# EAGLE board LEDprotoFix (EAGLE 6.6.0), part 1 of 2
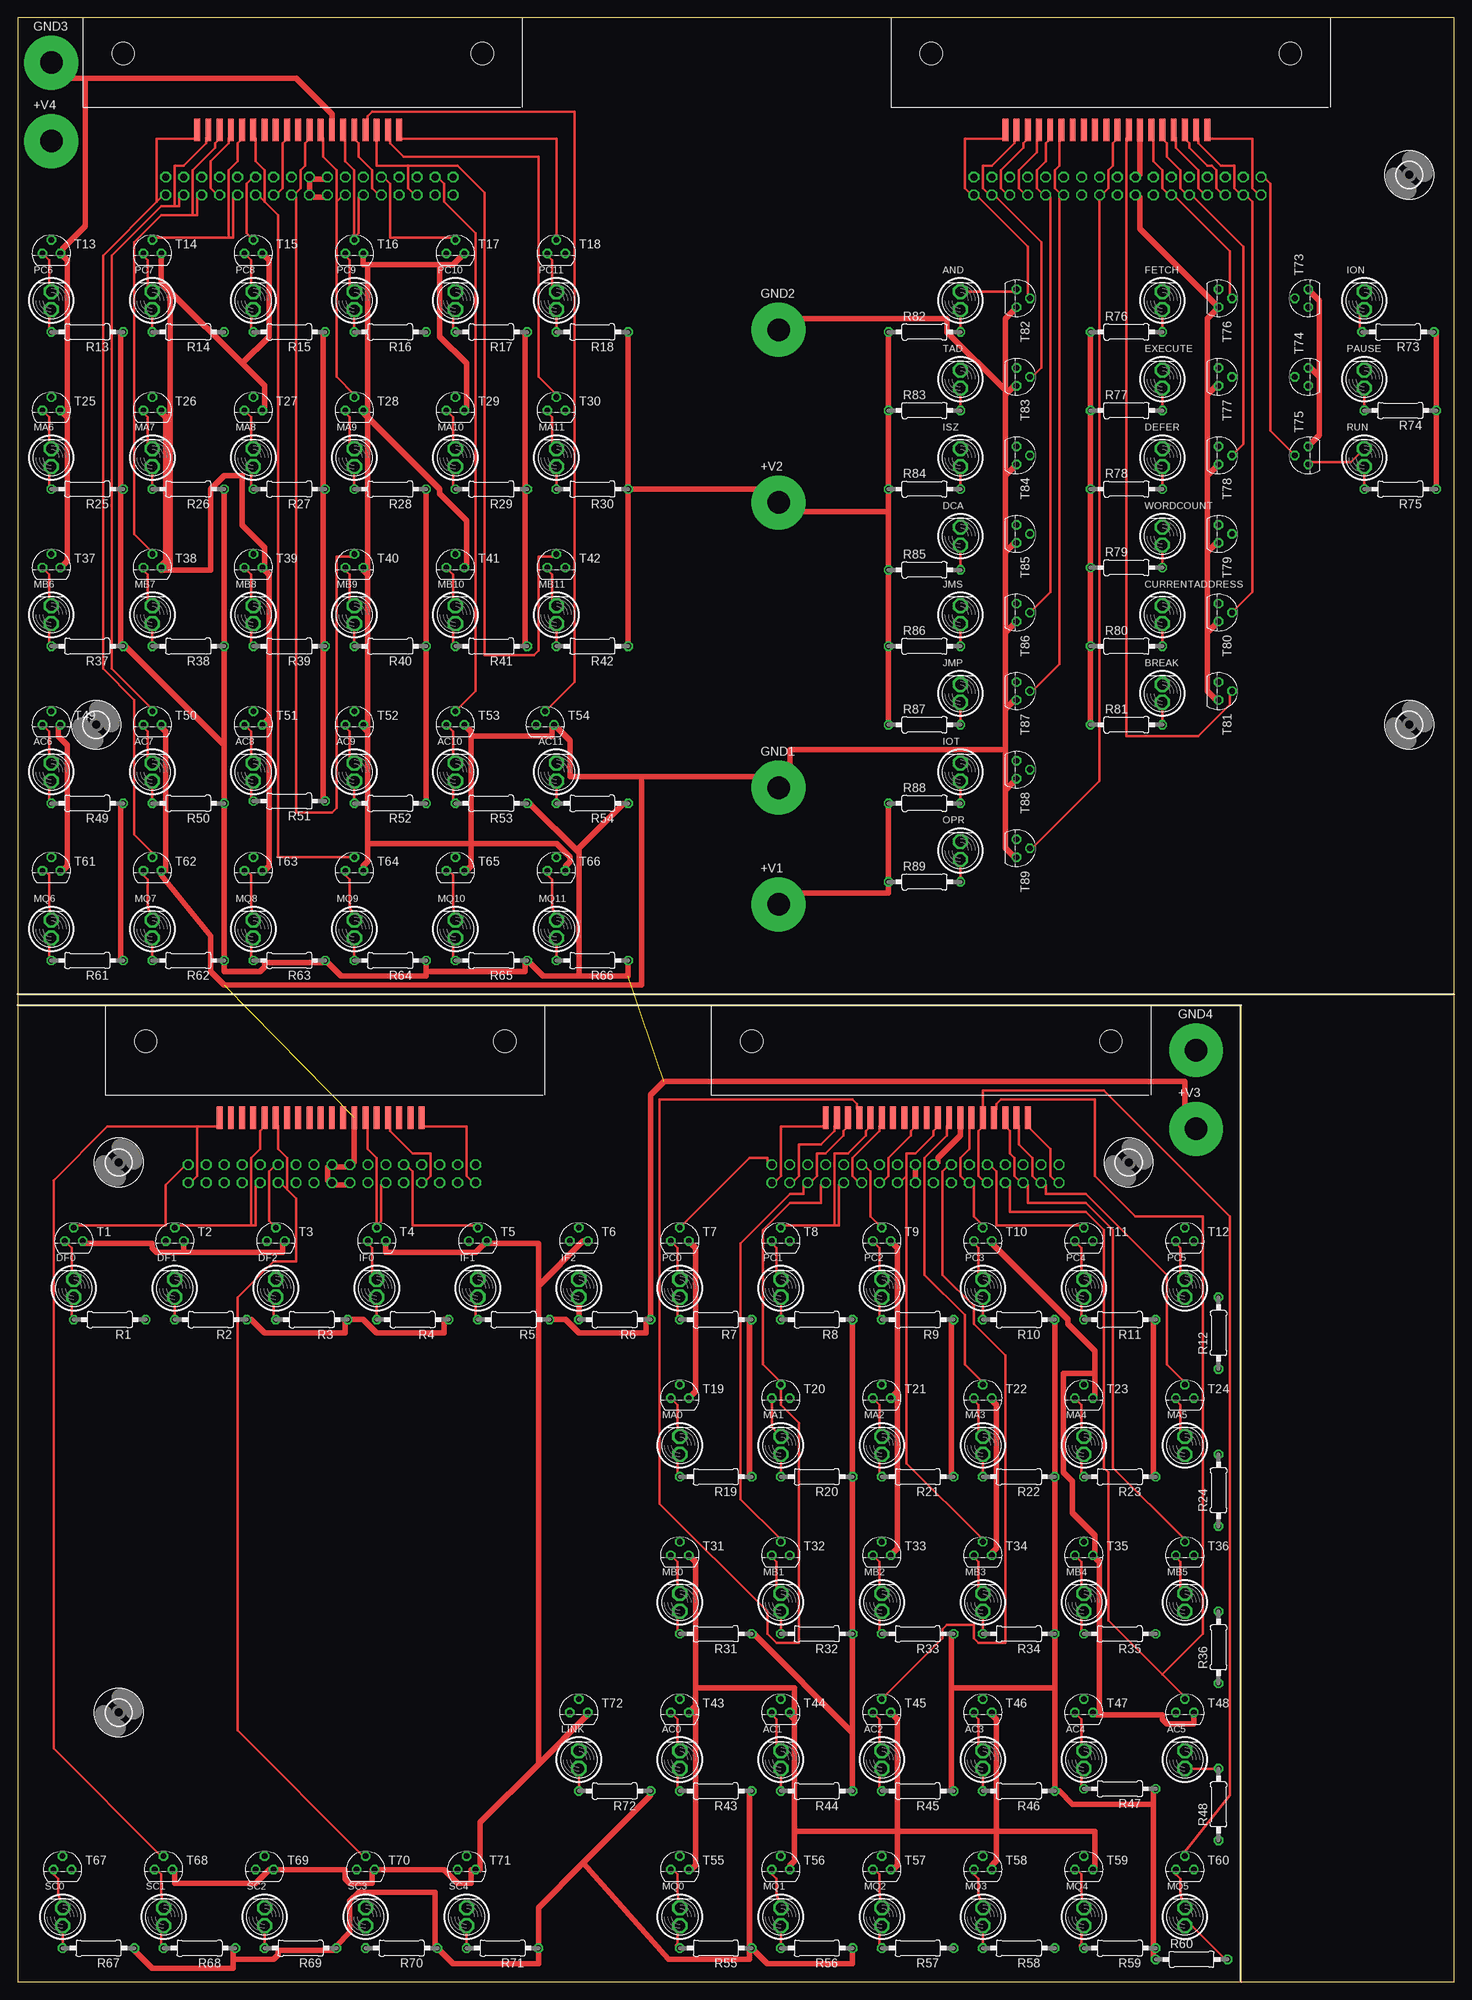
[diagram p2: board, top side]
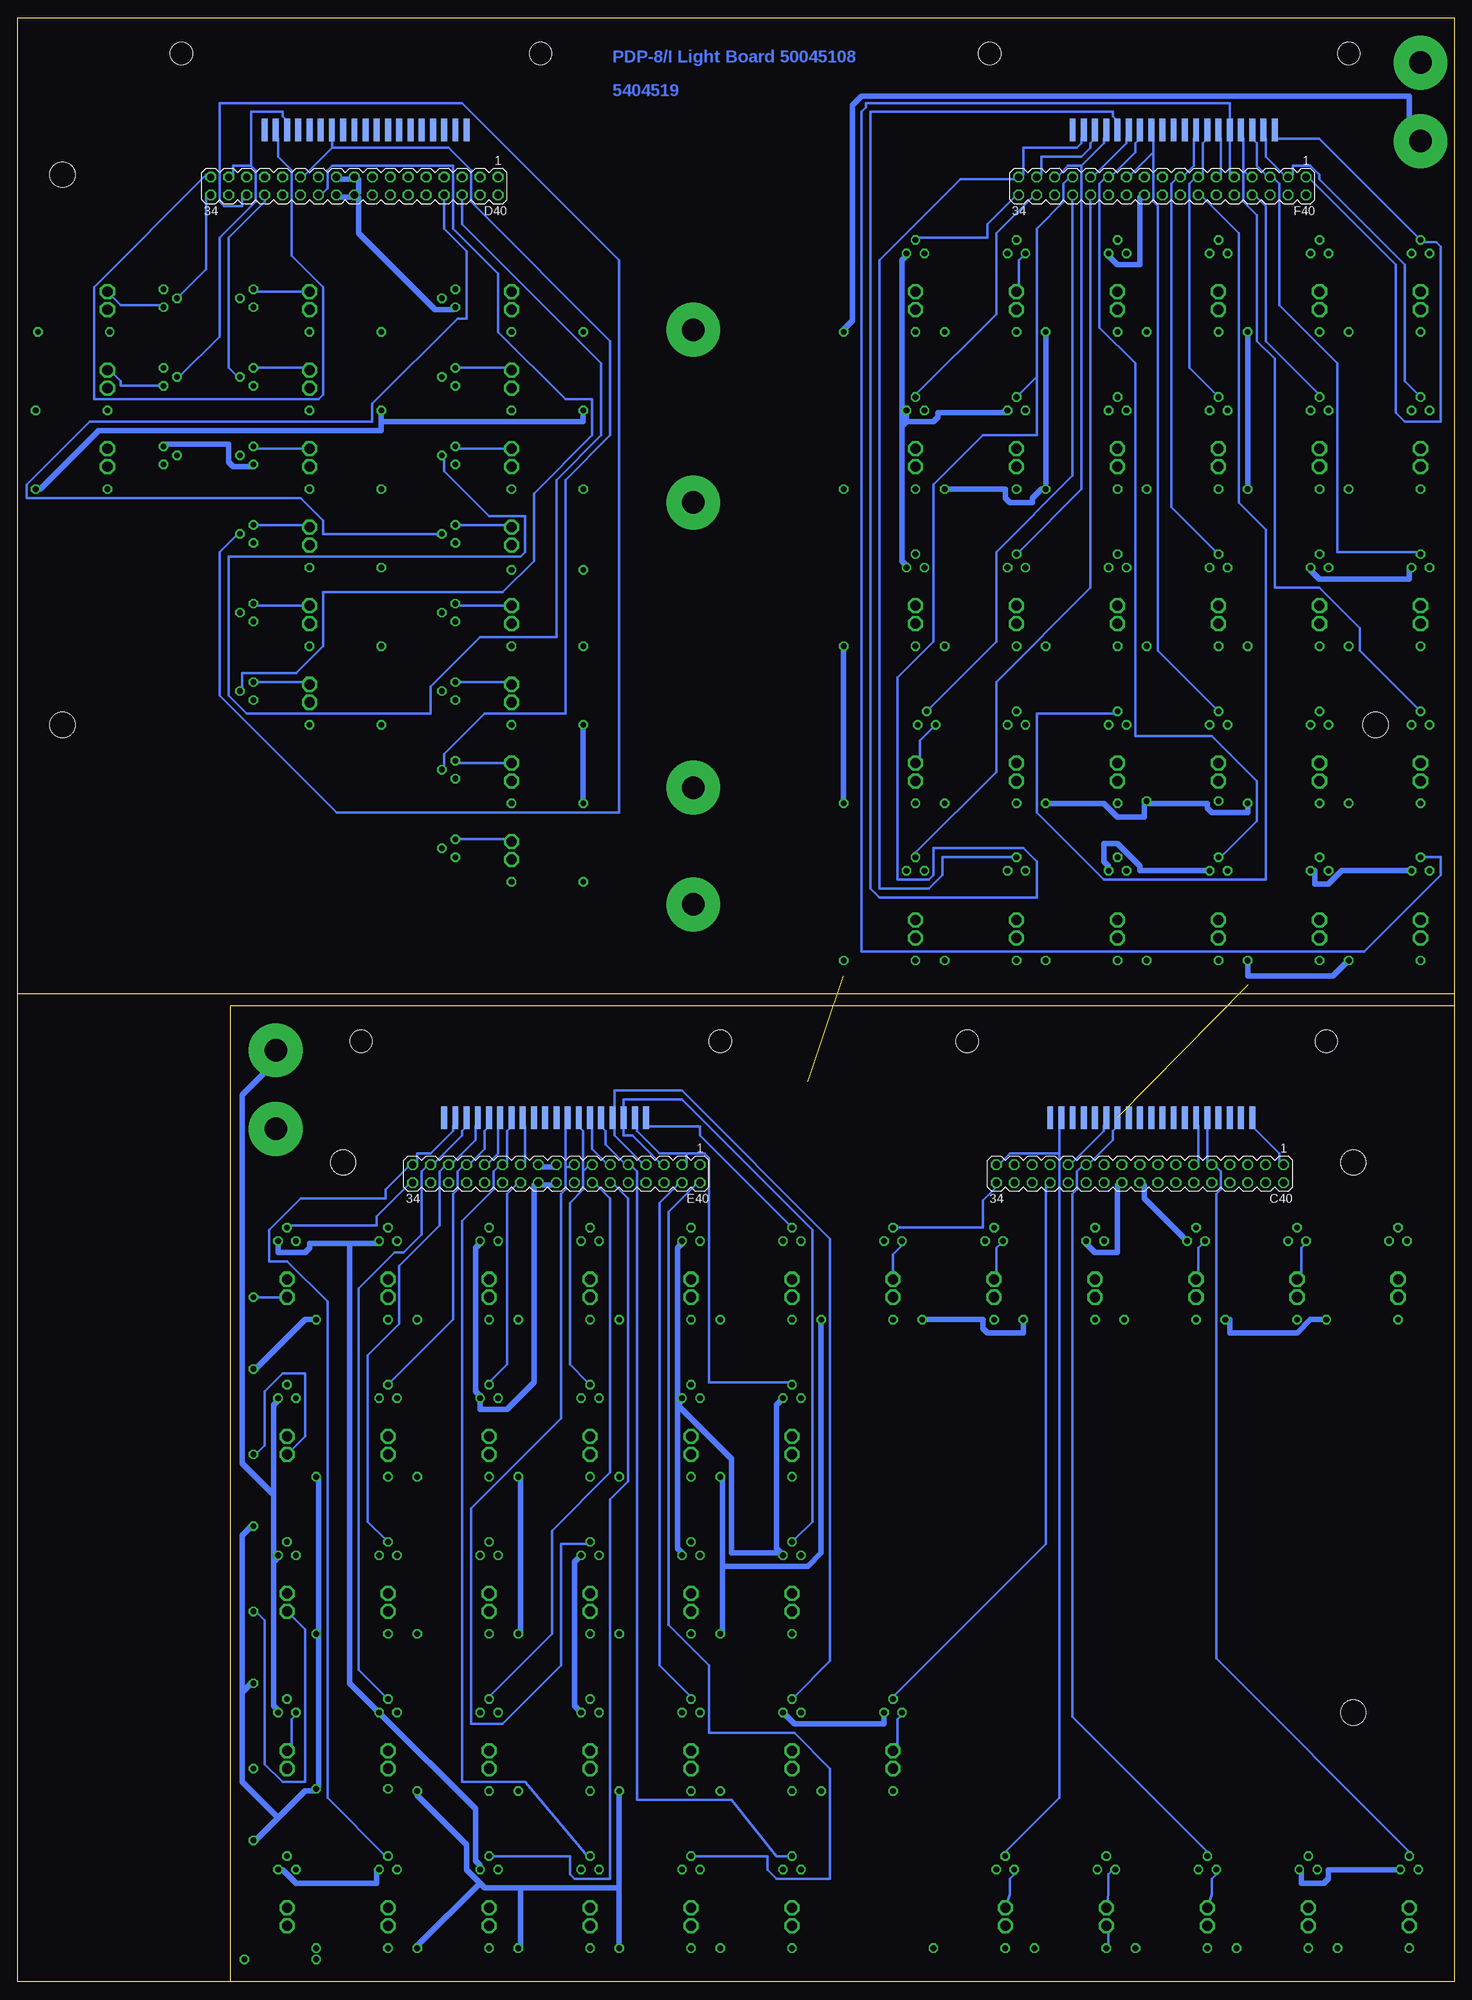
[diagram p3: board, bottom side, seen from below]

Size 203.2 x 277.81 mm. Coordinates in mm from the lower left corner, seen from the top.
Outline: 203.2,277.81 203.2,139.7 0,139.7 0,277.81
Outline: 203.2,277.81 0,277.81
Outline: 0,0 0,138.11 173.04,138.11 173.04,0 0,0
Outline: 0,0 203.2,0 203.2,277.81
Outline: 203.2,277.81 0,277.81
Outline: 0,277.81 0,0
Copper layers (1*16): Top 0.035mm / dielectric 1.5mm / Bottom 0.035mm
Design rules "15mils": minimum track width 15mil, minimum drill 24mil, track to track 15mil, track to pad 10mil, pad to pad 10mil, via to via 10mil, smd to smd 10mil, copper to edge 25mil, drill to drill 10mil, minimum pad ring 10mil, minimum via ring 8mil, stop-mask expansion 0mil, vias tented up to drill 0mil, thermal gap 10mil
Net classes: 1 supply: width 0.762 mm

## Footprints (pad centres in the part's own frame; a part is rotated, then mirrored left to right if it is on the bottom)
SPADELUG = drill 3.175 pad 7.62: 1 0,0
BULB = drill 1.422 octagon: A 0,0; B 0,2.54
MA17-2 = drill 1.016 octagon: 1 -20.32,-1.27; 2 -20.32,1.27; 3 -17.78,-1.27; 4 -17.78,1.27; 5 -15.24,-1.27; 6 -15.24,1.27; 7 -12.7,-1.27; 8 -12.7,1.27; 9 -10.16,-1.27; 10 -10.16,1.27; 11 -7.62,-1.27; 12 -7.62,1.27; 13 -5.08,-1.27; 14 -5.08,1.27; 15 -2.54,-1.27; 16 -2.54,1.27; 17 0,-1.27; 18 0,1.27; 19 2.54,-1.27; 20 2.54,1.27; 21 5.08,-1.27; 22 5.08,1.27; 23 7.62,-1.27; 24 7.62,1.27; 25 10.16,-1.27; 26 10.16,1.27; 27 12.7,-1.27; 28 12.7,1.27; 29 15.24,-1.27; 30 15.24,1.27; 31 17.78,-1.27; 32 17.78,1.27; 33 20.32,-1.27; 34 20.32,1.27
FLEX19 = smd 3.175 x 0.838: 1 0,14.287; 2 0,12.7; 3 0,11.113; 4 0,9.525; 5 0,7.938; 6 0,6.35; 7 0,4.763; 8 0,3.175; 9 0,1.587; 10 0,0; 11 0,-1.587; 12 0,-3.175; 13 0,-4.763; 14 0,-6.35; 15 0,-7.938; 16 0,-9.525; 17 0,-11.113; 18 0,-12.7; 19 0,-14.287
0207/10 = drill 0.813 octagon: 1 -5.08,0; 2 5.08,0
TO92 = drill 0.813 octagon: 1 1.27,0; 2 0,1.905; 3 -1.27,0
STRAIN-RELIEF = hole 3.175: 7.62,56.515; 7.62,5.715
3,6 = hole 3.6: 0,0

## Placement (x,y rotation side)
+V1  LUG  [SPADELUG]  107.63,152.4 0 top
+V2  LUG  [SPADELUG]  107.63,209.23 0 top
+V3  LUG  [SPADELUG]  166.69,120.65 0 top
+V4  LUG  [SPADELUG]  4.76,260.35 0 top
AC0  [BULB]  93.66,30.16 0 top
AC1  [BULB]  107.95,30.16 0 top
AC2  [BULB]  122.24,30.16 0 top
AC3  [BULB]  136.53,30.16 0 top
AC4  [BULB]  150.81,30.16 0 top
AC5  [BULB]  165.1,30.16 0 top
AC6  [BULB]  4.76,169.86 0 top
AC7  [BULB]  19.05,169.86 0 top
AC8  [BULB]  33.34,169.86 0 top
AC9  [BULB]  47.62,169.86 0 top
AC10  [BULB]  61.91,169.86 0 top
AC11  [BULB]  76.2,169.86 0 top
AND  [BULB]  133.35,236.54 0 top
BREAK  [BULB]  161.93,180.97 0 top
C40  [MA17-2]  44.45,114.3 180 bottom
C40BOT  FLEX19  [FLEX19]  42.86,122.24 90 top
C40TOP  FLEX19  [FLEX19]  42.86,122.24 270 bottom
CURRENTADDRESS  [BULB]  161.93,192.09 0 top
D40  [MA17-2]  155.57,254 180 bottom
D40BOT  FLEX19  [FLEX19]  128.59,122.24 90 top
D40TOP  FLEX19  [FLEX19]  128.59,122.24 270 bottom
DCA  [BULB]  133.35,203.2 0 top
DEFER  [BULB]  161.93,214.31 0 top
DF0  [BULB]  7.94,96.84 0 top
DF1  [BULB]  22.23,96.84 0 top
DF2  [BULB]  36.51,96.84 0 top
E40  [MA17-2]  127,114.3 180 bottom
E40BOT  FLEX19  [FLEX19]  39.69,261.94 90 top
E40TOP  FLEX19  [FLEX19]  39.69,261.94 270 bottom
EXECUTE  [BULB]  161.93,225.43 0 top
F40  [MA17-2]  41.27,254 180 bottom
F40BOT  FLEX19  [FLEX19]  153.99,261.94 90 top
F40TOP  FLEX19  [FLEX19]  153.99,261.94 270 bottom
FETCH  [BULB]  161.93,236.54 0 top
GND1  LUG  [SPADELUG]  107.63,168.91 0 top
GND2  LUG  [SPADELUG]  107.63,233.68 0 top
GND3  LUG  [SPADELUG]  4.76,271.46 0 top
GND4  LUG  [SPADELUG]  166.69,131.76 0 top
IF0  [BULB]  50.8,96.84 0 top
IF1  [BULB]  65.09,96.84 0 top
IF2  [BULB]  79.38,96.84 0 top
ION  [BULB]  190.5,236.54 0 top
IOT  [BULB]  133.35,169.86 0 top
ISZ  [BULB]  133.35,214.31 0 top
JMP  [BULB]  133.35,180.97 0 top
JMS  [BULB]  133.35,192.09 0 top
LINK  [BULB]  79.38,30.16 0 top
MA0  [BULB]  93.66,74.61 0 top
MA1  [BULB]  107.95,74.61 0 top
MA2  [BULB]  122.24,74.61 0 top
MA3  [BULB]  136.53,74.61 0 top
MA4  [BULB]  150.81,74.61 0 top
MA5  [BULB]  165.1,74.61 0 top
MA6  [BULB]  4.76,214.31 0 top
MA7  [BULB]  19.05,214.31 0 top
MA8  [BULB]  33.34,214.31 0 top
MA9  [BULB]  47.62,214.31 0 top
MA10  [BULB]  61.91,214.31 0 top
MA11  [BULB]  76.2,214.31 0 top
MB0  [BULB]  93.66,52.39 0 top
MB1  [BULB]  107.95,52.39 0 top
MB2  [BULB]  122.24,52.39 0 top
MB3  [BULB]  136.53,52.39 0 top
MB4  [BULB]  150.81,52.39 0 top
MB5  [BULB]  165.1,52.39 0 top
MB6  [BULB]  4.76,192.09 0 top
MB7  [BULB]  19.05,192.09 0 top
MB8  [BULB]  33.34,192.09 0 top
MB9  [BULB]  47.62,192.09 0 top
MB10  [BULB]  61.91,192.09 0 top
MB11  [BULB]  76.2,192.09 0 top
MQ0  [BULB]  93.66,7.94 0 top
MQ1  [BULB]  107.95,7.94 0 top
MQ2  [BULB]  122.24,7.94 0 top
MQ3  [BULB]  136.53,7.94 0 top
MQ4  [BULB]  150.81,7.94 0 top
MQ5  [BULB]  165.1,7.94 0 top
MQ6  [BULB]  4.76,147.64 0 top
MQ7  [BULB]  19.05,147.64 0 top
MQ8  [BULB]  33.34,147.64 0 top
MQ9  [BULB]  47.62,147.64 0 top
MQ10  [BULB]  61.91,147.64 0 top
MQ11  [BULB]  76.2,147.64 0 top
OPR  [BULB]  133.35,158.75 0 top
PAUSE  [BULB]  190.5,225.43 0 top
PC0  [BULB]  93.66,96.84 0 top
PC1  [BULB]  107.95,96.84 0 top
PC2  [BULB]  122.24,96.84 0 top
PC3  [BULB]  136.53,96.84 0 top
PC4  [BULB]  150.81,96.84 0 top
PC5  [BULB]  165.1,96.84 0 top
PC6  [BULB]  4.76,236.54 0 top
PC7  [BULB]  19.05,236.54 0 top
PC8  [BULB]  33.34,236.54 0 top
PC9  [BULB]  47.62,236.54 0 top
PC10  [BULB]  61.91,236.54 0 top
PC11  [BULB]  76.2,236.54 0 top
R1  1.5K  [0207/10]  13.02,93.66 180 top
R2  1.5K  [0207/10]  27.3,93.66 180 top
R3  1.5K  [0207/10]  41.59,93.66 180 top
R4  1.5K  [0207/10]  55.88,93.66 180 top
R5  1.5K  [0207/10]  70.17,93.66 180 top
R6  1.5K  [0207/10]  84.45,93.66 180 top
R7  1.5K  [0207/10]  98.74,93.66 180 top
R8  1.5K  [0207/10]  113.03,93.66 180 top
R9  1.5K  [0207/10]  127.32,93.66 180 top
R10  1.5K  [0207/10]  141.6,93.66 180 top
R11  1.5K  [0207/10]  155.89,93.66 180 top
R12  1.5K  [0207/10]  169.86,91.76 90 top
R13  1.5K  [0207/10]  9.84,233.36 180 top
R14  1.5K  [0207/10]  24.13,233.36 180 top
R15  1.5K  [0207/10]  38.42,233.36 180 top
R16  1.5K  [0207/10]  52.7,233.36 180 top
R17  1.5K  [0207/10]  66.99,233.36 180 top
R18  1.5K  [0207/10]  81.28,233.36 180 top
R19  1.5K  [0207/10]  98.74,71.44 180 top
R20  1.5K  [0207/10]  113.03,71.44 180 top
R21  1.5K  [0207/10]  127.32,71.44 180 top
R22  1.5K  [0207/10]  141.6,71.44 180 top
R23  1.5K  [0207/10]  155.89,71.44 180 top
R24  1.5K  [0207/10]  169.86,69.53 90 top
R25  1.5K  [0207/10]  9.84,211.14 180 top
R26  1.5K  [0207/10]  24.13,211.14 180 top
R27  1.5K  [0207/10]  38.42,211.14 180 top
R28  1.5K  [0207/10]  52.7,211.14 180 top
R29  1.5K  [0207/10]  66.99,211.14 180 top
R30  1.5K  [0207/10]  81.28,211.14 180 top
R31  1.5K  [0207/10]  98.74,49.21 180 top
R32  1.5K  [0207/10]  113.03,49.21 180 top
R33  1.5K  [0207/10]  127.32,49.21 180 top
R34  1.5K  [0207/10]  141.6,49.21 180 top
R35  1.5K  [0207/10]  155.89,49.21 180 top
R36  1.5K  [0207/10]  169.86,47.31 90 top
R37  1.5K  [0207/10]  9.84,188.91 180 top
R38  1.5K  [0207/10]  24.13,188.91 180 top
R39  1.5K  [0207/10]  38.42,188.91 180 top
R40  1.5K  [0207/10]  52.7,188.91 180 top
R41  1.5K  [0207/10]  66.99,188.91 180 top
R42  1.5K  [0207/10]  81.28,188.91 180 top
R43  1.5K  [0207/10]  98.74,26.99 180 top
R44  1.5K  [0207/10]  113.03,26.99 180 top
R45  1.5K  [0207/10]  127.32,26.99 180 top
R46  1.5K  [0207/10]  141.6,26.99 180 top
R47  1.5K  [0207/10]  155.89,27.3 180 top
R48  1.5K  [0207/10]  169.86,25.08 90 top
R49  1.5K  [0207/10]  9.84,166.69 180 top
R50  1.5K  [0207/10]  24.13,166.69 180 top
R51  1.5K  [0207/10]  38.42,167 180 top
R52  1.5K  [0207/10]  52.7,166.69 180 top
R53  1.5K  [0207/10]  66.99,166.69 180 top
R54  1.5K  [0207/10]  81.28,166.69 180 top
R55  1.5K  [0207/10]  98.74,4.76 180 top
R56  1.5K  [0207/10]  113.03,4.76 180 top
R57  1.5K  [0207/10]  127.32,4.76 180 top
R58  1.5K  [0207/10]  141.6,4.76 180 top
R59  1.5K  [0207/10]  155.89,4.76 180 top
R60  1.5K  [0207/10]  166.05,3.17 0 top
R61  1.5K  [0207/10]  9.84,144.46 180 top
R62  1.5K  [0207/10]  24.13,144.46 180 top
R63  1.5K  [0207/10]  38.42,144.46 180 top
R64  1.5K  [0207/10]  52.7,144.46 180 top
R65  1.5K  [0207/10]  66.99,144.46 180 top
R66  1.5K  [0207/10]  81.28,144.46 180 top
R67  1.5K  [0207/10]  11.43,4.76 180 top
R68  1.5K  [0207/10]  25.72,4.76 180 top
R69  1.5K  [0207/10]  40.01,4.76 180 top
R70  1.5K  [0207/10]  54.29,4.76 180 top
R71  1.5K  [0207/10]  68.58,4.76 180 top
R72  1.5K  [0207/10]  84.45,26.99 180 top
R73  1.5K  [0207/10]  195.26,233.36 180 top
R74  1.5K  [0207/10]  195.58,222.25 180 top
R75  1.5K  [0207/10]  195.58,211.14 180 top
R76  1.5K  [0207/10]  156.84,233.36 0 top
R77  1.5K  [0207/10]  156.84,222.25 0 top
R78  1.5K  [0207/10]  156.84,211.14 0 top
R79  1.5K  [0207/10]  156.84,200.03 0 top
R80  1.5K  [0207/10]  156.84,188.91 0 top
R81  1.5K  [0207/10]  156.84,177.8 0 top
R82  1.5K  [0207/10]  128.27,233.36 0 top
R83  1.5K  [0207/10]  128.27,222.25 0 top
R84  1.5K  [0207/10]  128.27,211.14 0 top
R85  1.5K  [0207/10]  128.27,199.71 0 top
R86  1.5K  [0207/10]  128.27,188.91 0 top
R87  1.5K  [0207/10]  128.27,177.8 0 top
R88  1.5K  [0207/10]  128.27,166.69 0 top
R89  1.5K  [0207/10]  128.27,155.57 0 top
RUN  [BULB]  190.5,214.31 0 top
SC0  [BULB]  6.35,7.94 0 top
SC1  [BULB]  20.64,7.94 0 top
SC2  [BULB]  34.92,7.94 0 top
SC3  [BULB]  49.21,7.94 0 top
SC4  [BULB]  63.5,7.94 0 top
T1  2N2222  [TO92]  7.94,104.78 0 top
T2  2N2222  [TO92]  22.23,104.78 0 top
T3  2N2222  [TO92]  36.51,104.78 0 top
T4  2N2222  [TO92]  50.8,104.78 0 top
T5  2N2222  [TO92]  65.09,104.78 0 top
T6  2N2222  [TO92]  79.38,104.78 0 top
T7  2N2222  [TO92]  93.66,104.78 0 top
T8  2N2222  [TO92]  107.95,104.78 0 top
T9  2N2222  [TO92]  122.24,104.78 0 top
T10  2N2222  [TO92]  136.53,104.78 0 top
T11  2N2222  [TO92]  150.81,104.78 0 top
T12  2N2222  [TO92]  165.1,104.78 0 top
T13  2N2222  [TO92]  4.76,244.47 0 top
T14  2N2222  [TO92]  19.05,244.47 0 top
T15  2N2222  [TO92]  33.34,244.47 0 top
T16  2N2222  [TO92]  47.62,244.47 0 top
T17  2N2222  [TO92]  61.91,244.47 0 top
T18  2N2222  [TO92]  76.2,244.47 0 top
T19  2N2222  [TO92]  93.66,82.55 0 top
T20  2N2222  [TO92]  107.95,82.55 0 top
T21  2N2222  [TO92]  122.24,82.55 0 top
T22  2N2222  [TO92]  136.53,82.55 0 top
T23  2N2222  [TO92]  150.81,82.55 0 top
T24  2N2222  [TO92]  165.1,82.55 0 top
T25  2N2222  [TO92]  4.76,222.25 0 top
T26  2N2222  [TO92]  19.05,222.25 0 top
T27  2N2222  [TO92]  33.34,222.25 0 top
T28  2N2222  [TO92]  47.62,222.25 0 top
T29  2N2222  [TO92]  61.91,222.25 0 top
T30  2N2222  [TO92]  76.2,222.25 0 top
T31  2N2222  [TO92]  93.66,60.33 0 top
T32  2N2222  [TO92]  107.95,60.33 0 top
T33  2N2222  [TO92]  122.24,60.33 0 top
T34  2N2222  [TO92]  136.53,60.33 0 top
T35  2N2222  [TO92]  150.81,60.33 0 top
T36  2N2222  [TO92]  165.1,60.33 0 top
T37  2N2222  [TO92]  4.76,200.03 0 top
T38  2N2222  [TO92]  19.05,200.03 0 top
T39  2N2222  [TO92]  33.34,200.03 0 top
T40  2N2222  [TO92]  47.62,200.03 0 top
T41  2N2222  [TO92]  61.91,200.03 0 top
T42  2N2222  [TO92]  76.2,200.03 0 top
T43  2N2222  [TO92]  93.66,38.1 0 top
T44  2N2222  [TO92]  107.95,38.1 0 top
T45  2N2222  [TO92]  122.24,38.1 0 top
T46  2N2222  [TO92]  136.53,38.1 0 top
T47  2N2222  [TO92]  150.81,38.1 0 top
T48  2N2222  [TO92]  165.1,38.1 0 top
T49  2N2222  [TO92]  4.76,177.8 0 top
T50  2N2222  [TO92]  19.05,177.8 0 top
T51  2N2222  [TO92]  33.34,177.8 0 top
T52  2N2222  [TO92]  47.62,177.8 0 top
T53  2N2222  [TO92]  61.91,177.8 0 top
T54  2N2222  [TO92]  74.61,177.8 0 top
T55  2N2222  [TO92]  93.66,15.88 0 top
T56  2N2222  [TO92]  107.95,15.88 0 top
T57  2N2222  [TO92]  122.24,15.88 0 top
T58  2N2222  [TO92]  136.53,15.88 0 top
T59  2N2222  [TO92]  150.81,15.88 0 top
T60  2N2222  [TO92]  165.1,15.88 0 top
T61  2N2222  [TO92]  4.76,157.16 0 top
T62  2N2222  [TO92]  19.05,157.16 0 top
T63  2N2222  [TO92]  33.34,157.16 0 top
T64  2N2222  [TO92]  47.62,157.16 0 top
T65  2N2222  [TO92]  61.91,157.16 0 top
T66  2N2222  [TO92]  76.2,157.16 0 top
T67  2N2222  [TO92]  6.35,15.88 0 top
T68  2N2222  [TO92]  20.64,15.88 0 top
T69  2N2222  [TO92]  34.92,15.88 0 top
T70  2N2222  [TO92]  49.21,15.88 0 top
T71  2N2222  [TO92]  63.5,15.88 0 top
T72  2N2222  [TO92]  79.38,38.1 0 top
T73  2N2222  [TO92]  182.56,238.12 90 top
T74  2N2222  [TO92]  182.56,227.01 90 top
T75  2N2222  [TO92]  182.56,215.9 90 top
T76  2N2222  [TO92]  169.86,238.12 270 top
T77  2N2222  [TO92]  169.86,227.01 270 top
T78  2N2222  [TO92]  169.86,215.9 270 top
T79  2N2222  [TO92]  169.86,204.79 270 top
T80  2N2222  [TO92]  169.86,193.68 270 top
T81  2N2222  [TO92]  169.86,182.56 270 top
T82  2N2222  [TO92]  141.29,238.12 270 top
T83  2N2222  [TO92]  141.29,227.01 270 top
T84  2N2222  [TO92]  141.29,215.9 270 top
T85  2N2222  [TO92]  141.29,204.79 270 top
T86  2N2222  [TO92]  141.29,193.68 270 top
T87  2N2222  [TO92]  141.29,182.56 270 top
T88  2N2222  [TO92]  141.29,171.45 270 top
T89  2N2222  [TO92]  141.29,160.34 270 top
TAD  [BULB]  133.35,225.43 0 top
U$1  [STRAIN-RELIEF]  74.61,125.41 90 top
U$2  [STRAIN-RELIEF]  160.34,125.41 90 top
U$3  [STRAIN-RELIEF]  71.44,265.11 90 top
U$4  [STRAIN-RELIEF]  185.74,265.11 90 top
U$5  [3,6]  196.85,255.59 0 top
U$6  [3,6]  196.85,177.8 0 top
U$7  [3,6]  11.11,177.8 0 top
U$8  [3,6]  14.29,38.1 0 top
U$9  [3,6]  14.29,115.89 0 top
U$11  [3,6]  157.16,115.89 0 top
WORDCOUNT  [BULB]  161.93,203.2 0 top